# EAGLE design lickometer v1.0 (EAGLE 9.6.2)
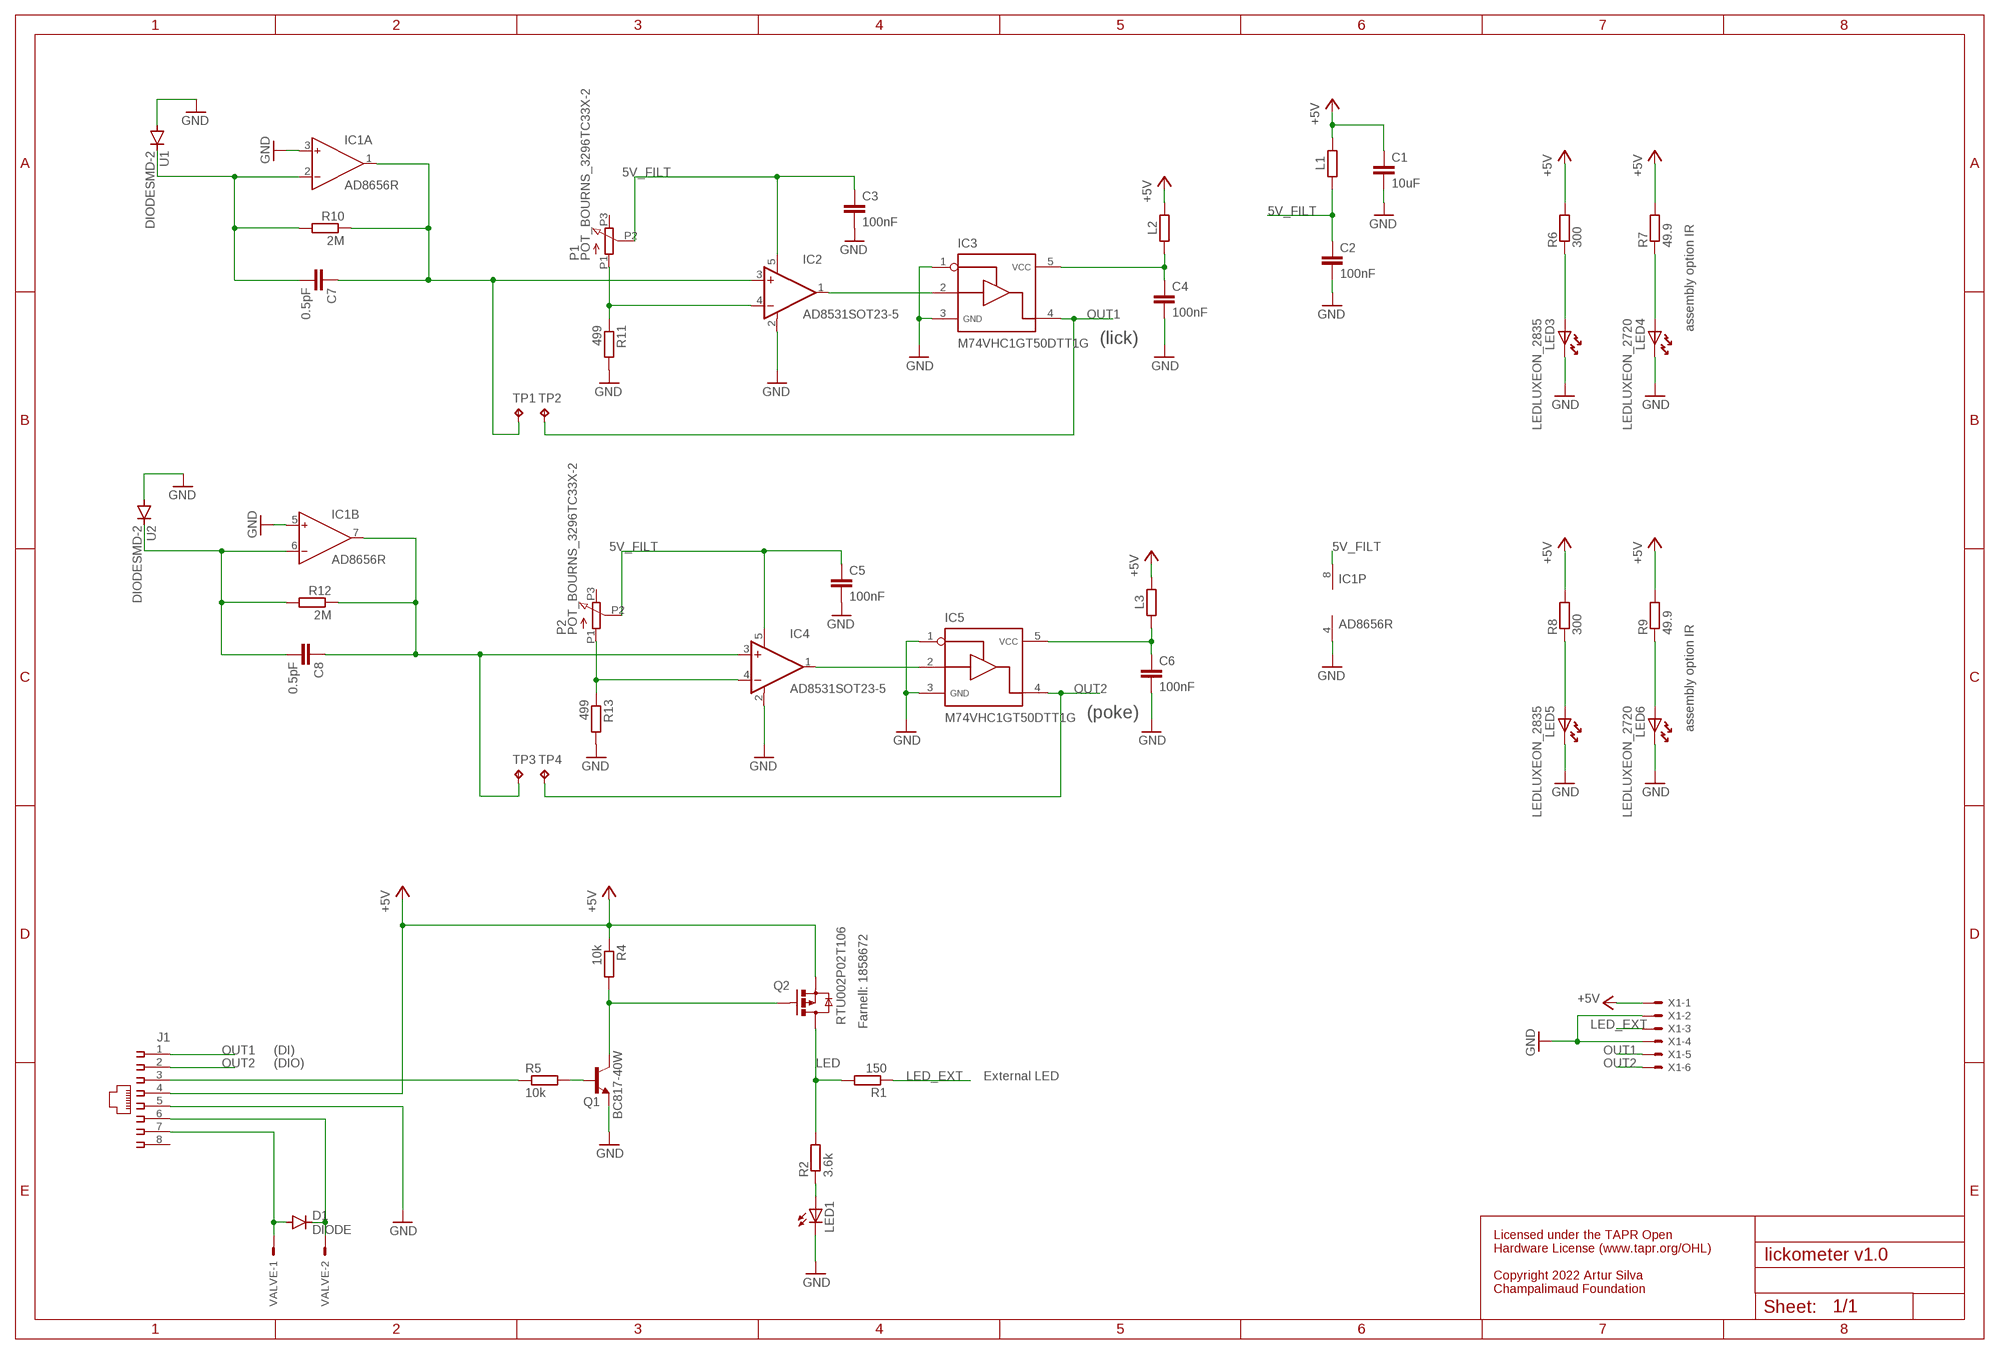
[diagram p0: schematic, sheet 1]

## Parts
C1  10uF  C-EUC0603  [C0603]
C2  100nF  C-EUC0402  [C0402]
C3  100nF  C-EUC0402  [C0402]
C4  100nF  C-EUC0402  [C0402]
C5  100nF  C-EUC0402  [C0402]
C6  100nF  C-EUC0402  [C0402]
C7  0.5pF  C-EUC0402  [C0402]
C8  0.5pF  C-EUC0402  [C0402]
D1  DIODE  [SOD-323-DIODE]
IC1  AD8656R  [SO8]
IC2  AD8531SOT23-5  [SOT23-5]
IC3  M74VHC1GT50DTT1G  SN74LVC1G125  [SOT23-5]
IC4  AD8531SOT23-5  [SOT23-5]
IC5  M74VHC1GT50DTT1G  SN74LVC1G125  [SOT23-5]
J1  215878-2  [215878-2]
L1  1k@100M  R-EU_R0402  [R0402]
L2  1k@100M  R-EU_R0402  [R0402]
L3  1k@100M  R-EU_R0402  [R0402]
LED1  LED3MM  [LED3MM]
LED3  LEDLUXEON_2835  [LED_LUXEON_2835]
LED4  LEDLUXEON_2720  [LED_LUXEON_2720]
LED5  LEDLUXEON_2835  [LED_LUXEON_2835]
LED6  LEDLUXEON_2720  [LED_LUXEON_2720]
P1  POT_BOURNS_3296TC33X-2  [POT-TC33X-2]
P2  POT_BOURNS_3296TC33X-2  [POT-TC33X-2]
Q1  BC817-40W  BC817  [SOT323-BEC]
Q2  RTU002P02T106  MOSFET-PCHANNEL-ROHM  [SOT323]
R1  150  R-EU_R0402  [R0402]
R2  3.6k  R-EU_R0402  [R0402]
R4  10k  R-EU_R0402  [R0402]
R5  10k  R-EU_R0402  [R0402]
R6  300  R-EU_R0805  [R0805]
R7  49.9  R-EU_R0805  [R0805]
R8  300  R-EU_R0805  [R0805]
R9  49.9  R-EU_R0805  [R0805]
R10  2M  R-EU_R0402  [R0402]
R11  499  R-EU_R0402  [R0402]
R12  2M  R-EU_R0402  [R0402]
R13  499  R-EU_R0402  [R0402]
TP1  TPTP08SQ  [TP08SQ]
TP2  TPTP08SQ  [TP08SQ]
TP3  TPTP08SQ  [TP08SQ]
TP4  TPTP08SQ  [TP08SQ]
U1  DIODESMD-2  [SMD-2]
U2  DIODESMD-2  [SMD-2]
VALVE  22-23-2021  [22-23-2021]
X1  22-23-2061  [22-23-2061]

## Nets
5V_FILT: C2.1 C3.1 C5.1 IC1.8(P:V+) IC2.5(V+) IC4.5(V+) L1.2 P1.P2(S) P2.P2(S)
+5V: C1.1 J1.4 L1.1 L2.2 L3.2 Q2.1(S) R4.1 R6.2 R7.2 R8.2 R9.2 X1.1
GND: C1.2 C2.2 C3.2 C4.2 C5.2 C6.2 IC1.3(A:IN+) IC1.4(P:V-) IC1.5(B:IN+) IC2.2(V-) IC3.1 IC3.3 IC4.2(V-) IC5.1 IC5.3 J1.5 LED1.K(C) LED3.KATHODE(K) LED4.KATHODE(K) LED5.KATHODE(K) LED6.KATHODE(K) Q1.E R11.2 R13.2 U1.A U2.A X1.2 X1.4
IN1: IC4.4(-IN) P2.P1(A) R13.1
IN2: IC2.4(-IN) P1.P1(A) R11.1
LED: Q2.3(D) R1.2 R2.2
LED_EXT: R1.1 X1.3
N$1: LED3.ANODE(A) R6.1
N$2: C4.1 IC3.5 L2.1
N$4: C7.2 IC1.2(A:IN-) R10.2 U1.C
N$5: D1.A J1.7 VALVE.1
N$6: D1.C J1.6 VALVE.2
N$7: IC2.1(OUT) IC3.2
N$8: J1.3 R5.1
N$9: C7.1 IC1.1(A:OUT) IC2.3(+IN) R10.1 TP1.TP
N$10: LED4.ANODE(A) R7.1
N$11: IC4.1(OUT) IC5.2
N$12: C6.1 IC5.5 L3.1
N$14: LED1.A R2.1
N$15: C8.2 IC1.6(B:IN-) R12.2 U2.C
N$16: C8.1 IC1.7(B:OUT) IC4.3(+IN) R12.1 TP3.TP
N$17: LED5.ANODE(A) R8.1
N$18: Q1.C Q2.2(G) R4.2
N$19: Q1.B R5.2
N$20: LED6.ANODE(A) R9.1
OUT1: IC3.4 J1.1 TP2.TP X1.5
OUT2: IC5.4 J1.2 TP4.TP X1.6
Unconnected: J1.8 P1.P3(E) P2.P3(E)

## Notes on the sheet
- assembly option IR
- (lick)
- (poke)
- assembly option IR
- Farnell: 1858672
- (DI)
- (DIO)
- External LED
- Licensed under the TAPR Open 
  Hardware License (www.tapr.org/OHL)
  
  Copyright 2022 Artur Silva
  Champalimaud Foundation

## Library data of the parts
C1-C8 = rcl:C-EU: CAPACITOR, European symbol; SPICEPREFIX: C
D1 U1 U2 = CNP-miscellaneous:DIODE
IC1 = analog-devices:AD8656: Low Noise, Precision CMOS Amplifier Source: http://www.analog.com/static/imported-files/data_sheets/AD8655_8656.pdf; MPN: AD8656ARZ; OC_FARNELL: 1117887; OC_NEWARK: 19M0993
IC2 IC4 = CNP-ics 1:AD8531
IC3 IC5 = My_library 0v2:SN74LVC1G125
J1 = con-amp:215878-2: AMP connector
L1-L3 R1 R2 R4-R13 = rcl:R-EU_: RESISTOR, European symbol; SPICEPREFIX: R
LED1 = adafruit:LED: LED OSRAM: - CHIPLED LG R971, LG N971, LY N971, LG Q971, LY Q971, LO R971, LY R971 LH N974, LH R974 LS Q976, LO Q976, LY Q976 LO Q996 - Hyper CHIPLED LW Q18S LB Q993, LB Q99A, LB R99A - SideLED LS A670, LO A670, LY A670, LG A670, LP A670 LB A673, LV A673, LT A673, LW A673 LH A674 LY A675 LS A676, LA A676, LO A676, LY A676, LW A676 LS A679, LY A679, LG A679 - Hyper Micro SIDELED® LS Y876, LA Y876, LO Y876, LY Y876 LT Y87S - SmartLED LW L88C, LW L88S LB L89C, LB L89S, LG L890 LS L89K, LO L89K, LY L89K LS L896, LA L896, LO L896, LY L896 - TOPLED LS T670, LO T670, LY T670, LG T670, LP T670 LSG T670, LSP T670, LSY T670, LOP T670, LYG T670 LG T671, LOG T671, LSG T671 LB T673, LV T673, LT T673, LW T673 LH T674 LS T676, LA T676, LO T676, LY T676, LB T676, LH T676, LSB T676, LW T676 LB T67C, LV T67C, LT T67C, LS T67K, LO T67K, LY T67K, LW E67C LS E67B, LA E67B, LO E67B, LY E67B, LB E67C, LV E67C, LT E67C LW T67C LS T679, LY T679, LG T679 LS T770, LO T770, LY T770, LG T770, LP T770 LB T773, LV T773, LT T773, LW T773 LH T774 LS E675, LA E675, LY E675, LS T675 LS T776, LA T776, LO T776, LY T776, LB T776 LHGB T686 LT T68C, LB T68C - Hyper Mini TOPLED® LB M676 - Mini TOPLED Santana® LG M470 LS M47K, LO M47K, LY M47K Source: http://www.osram.convergy.de/
LED3-LED6 = CNP-miscellaneous:LED
P1 P2 = CNP-miscellaneous:POT_BOURNS_3296
Q1 = transistor-npn:BC817*: NPN Transistor
Q2 = MOSFET:MOSFET-PCHANNEL-ROHM: PMOS (RTU002P02) Low On-Resistance. Low Gate Threshold Voltage. Low Input Capacitance. Fast Switching Speed. Manufacturer: ROHM
TP1-TP4 = testpad:TP: Test pad
VALVE = con-molex:22-23-2021: .100" (2.54mm) Center Header - 2 Pin; MF: MOLEX; MPN: 22-23-2021; OC_FARNELL: 1462926; OC_NEWARK: 25C3832
X1 = con-molex:22-23-2061: .100" (2.54mm) Center Header - 6 Pin; MF: MOLEX; MPN: 22-23-2061; OC_FARNELL: 1462922; OC_NEWARK: 27C1933

## Board
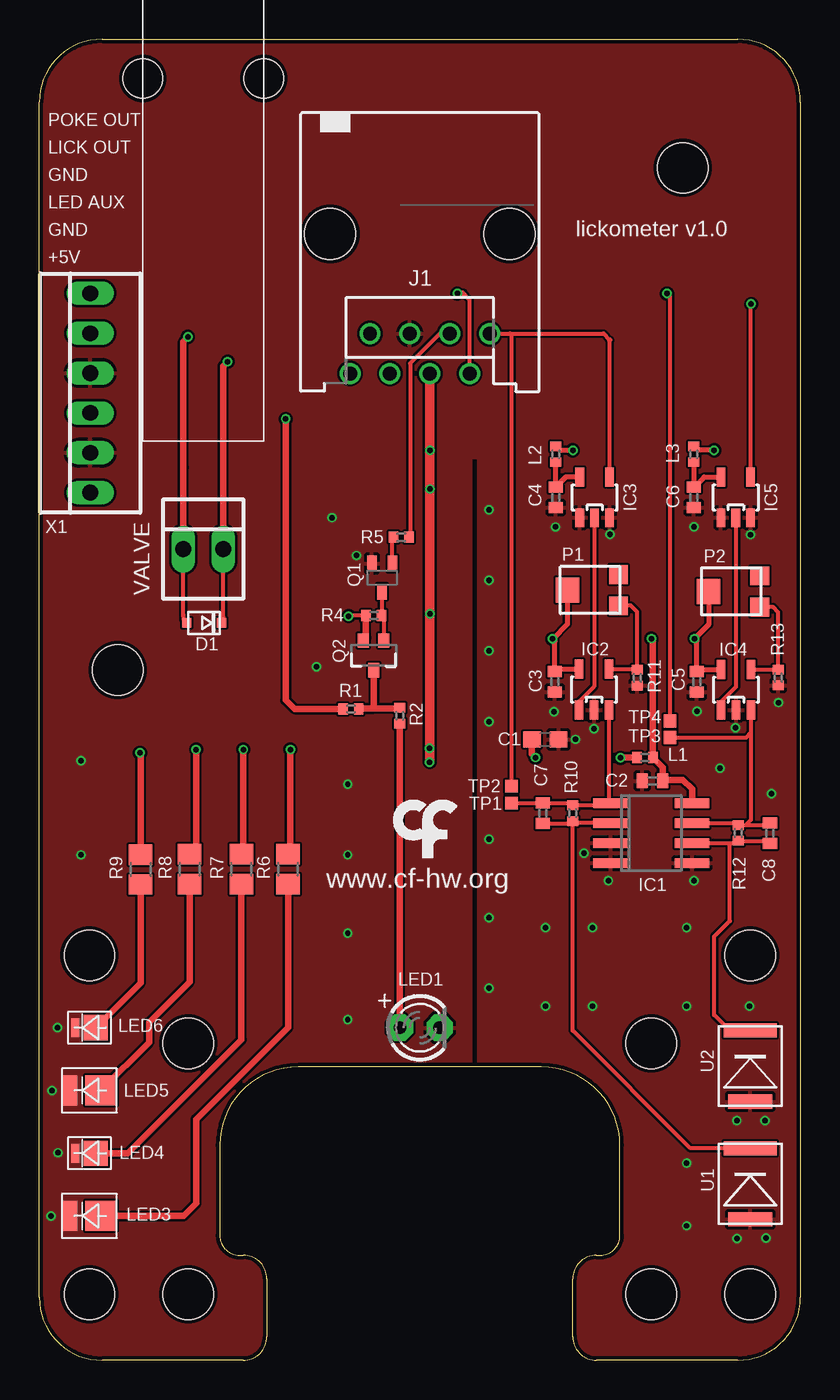
[diagram p1: board, top side]
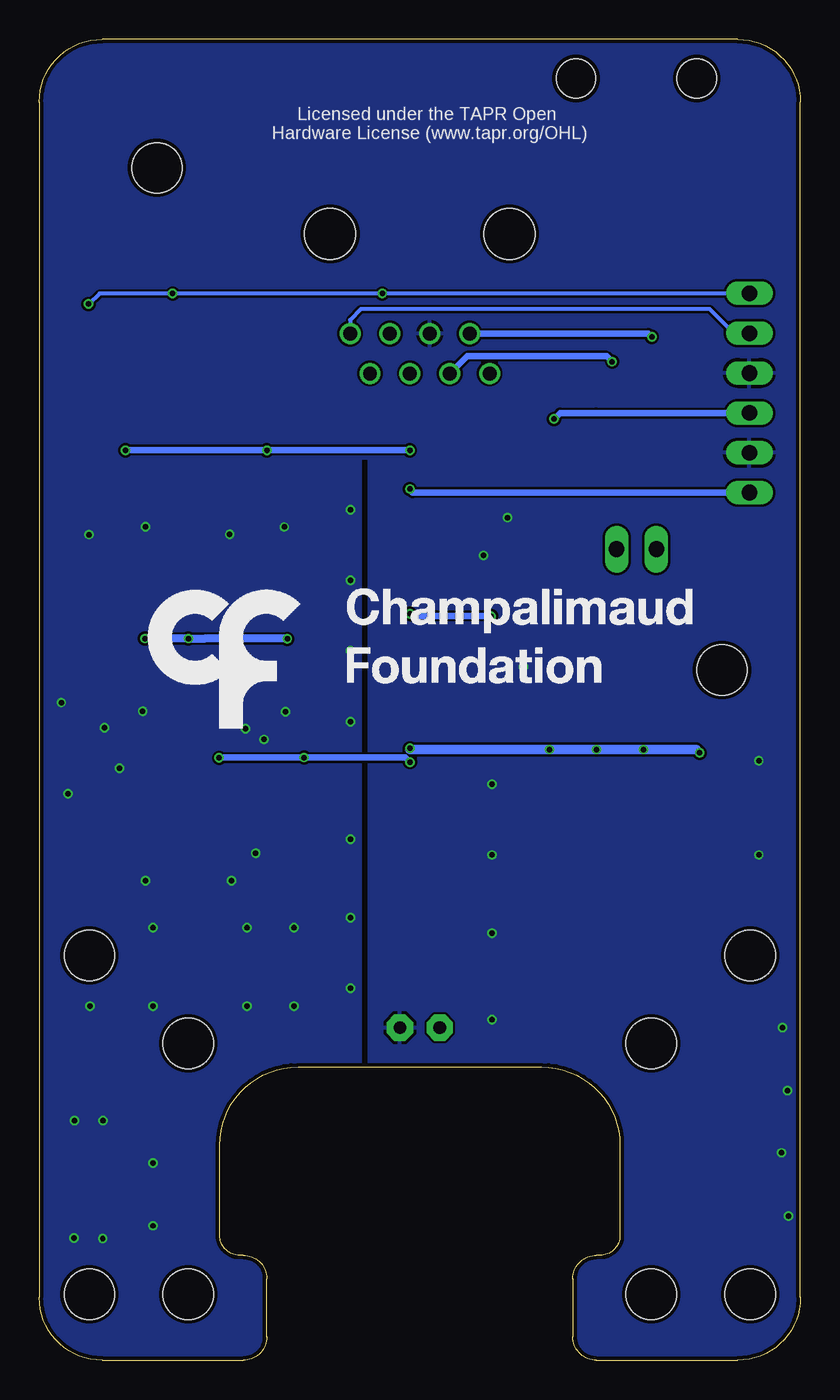
[diagram p2: board, bottom side, seen from below]

Size 48.5 x 84.2 mm. Coordinates in mm from the lower left corner, seen from the top.
Outline: 11.5,7.95 arc90 12.75,6.7 13,6.7 arc-90 14.5,5.2 14.5,1.5 arc-90 13,0 4,0 arc-90 0,4 0,80.2 arc-90 4,84.2 44.5,84.2 arc-90 48.5,80.2 48.5,4 arc-90 44.5,0 35.5,0 arc-90 34,1.5 34,5.2 arc-90 35.5,6.7 35.75,6.7 arc90 37,7.95 37,13.7 arc90 32,18.7 16.5,18.7 arc90 11.5,13.7 11.5,7.95
Copper layers (1*16): Top 0.018mm / dielectric 1.55mm / Bottom 0.018mm
Design rules "eC_2Layer_PClass6_BaseCopperO18_eCDefault *": minimum track width 0.15mm, minimum drill 0.35mm, track to track 0.15mm, track to pad 0.15mm, pad to pad 0.15mm, via to via 0.15mm, smd to smd 0mil, copper to edge 0.25mm, drill to drill 0.35mm, minimum pad ring 0.175mm, minimum via ring 0.125mm, stop-mask expansion 0mil, vias tented up to drill 0.45mm, thermal gap 0.2mm
Holes 3.2 mm at 41,76 3.2,4.2 39,4.2 3.2,25.8 39,20.2 9.5,20.2 45.3,4.2 9.5,4.2 45.3,25.8 5,44
Holes 2.5 mm at 14.3,81.7 6.6,81.7

### Footprints (pad centres in the part's own frame; a part is rotated, then mirrored left to right if it is on the bottom)
C0603 = smd 1.1 x 1: 1 -0.85,0; 2 0.85,0
C0402 = smd 0.7 x 0.9: 1 -0.65,0; 2 0.65,0
SOD-323-DIODE = smd 0.6 x 0.6: A 1.1,0; C -1.1,0
SO8 = smd 0.6 x 2.2: 1 -1.905,-2.6; 2 -0.635,-2.6; 3 0.635,-2.6; 4 1.905,-2.6; 5 1.905,2.6; 6 0.635,2.6; 7 -0.635,2.6; 8 -1.905,2.6
SOT23-5 = smd 0.55 x 1.2: 1 -0.95,-1.3; 2 0,-1.3; 3 0.95,-1.3; 4 0.95,1.3; 5 -0.95,1.3
215878-2 = drill 0.889: 1 -4.445,6.35; 2 -3.175,8.89; 3 -1.905,6.35; 4 -0.635,8.89; 5 0.635,6.35; 6 1.905,8.89; 7 3.175,6.35; 8 4.445,8.89 | hole 3.251: -5.715,0; 5.715,0
R0402 = smd 0.6 x 0.7: 1 -0.5,0; 2 0.5,0
LED3MM = drill 0.813 pad 1.676 octagon: A -1.27,0; K 1.27,0
LED_LUXEON_2835 = smd 2.03 x 1.9: ANODE 0.735,0 | smd 0.97 x 1.9: KATHODE -1.265,0
LED_LUXEON_2720 = smd 1.5 x 1.6: ANODE 0.4,0 | smd 0.5 x 1.2: KATHODE -0.9,0
POT-TC33X-2 = smd 1.2 x 1.2: P1 -1,-1.8; P3 1,-1.8 | smd 1.6 x 1.5: P2 0,1.45
SOT323-BEC = smd 0.6 x 1: B -0.65,-0.9; C 0,0.9; E 0.65,-0.9
SOT323 = smd 0.7 x 0.9: 1 0.65,-0.95; 2 -0.65,-0.95; 3 0,0.95
R0805 = smd 1.3 x 1.5: 1 -0.95,0; 2 0.95,0
TP08SQ = smd 0.8 x 0.8: TP 0,0
SMD-2 = smd 0.9 x 2.8: A 2.265,0 | smd 0.9 x 3.4: C -2.265,0
22-23-2021 = drill 1 long: 1 -1.27,0; 2 1.27,0
22-23-2061 = drill 1 long: 1 -6.35,0; 2 -3.81,0; 3 -1.27,0; 4 1.27,0; 5 3.81,0; 6 6.35,0

### Placement (x,y rotation side)
C1  32.24,39.56 0 top
C2  39.08,36.94 180 top
C3  32.85,43.25 270 top
C4  32.9,55 270 top
C5  41.9,43.24 270 top
C6  41.71,55 270 top
C7  32.08,34.86 270 top
C8  46.56,33.6 270 top
D1  10.5,47 180 top
IC1  39,33.6 270 top
IC2  35.35,42.75 0 top
IC3  35.39,55 0 top
IC4  44.4,42.74 0 top
IC5  44.38,55 0 top
J1  24.25,71.79 180 top
L1  38.59,38.41 0 top
L2  32.9,57.75 90 top
L3  41.71,57.75 90 top
LED1  24.25,21.2 0 top
LED3  3.2,9.2 0 top
LED4  3.2,13.2 0 top
LED5  3.2,17.2 0 top
LED6  3.2,21.2 0 top
P1  35.11,49.09 90 top
P2  44.1,49 90 top
Q1  21.85,49.88 180 top
Q2  21.31,44.93 180 top
R1  19.86,41.53 0 top
R2  22.98,41.08 90 top
R4  21.32,47.45 0 top
R5  23.07,52.45 180 top
R6  15.85,31.3 90 top
R7  12.87,31.3 90 top
R8  9.58,31.3 90 top
R9  6.45,31.28 90 top
R10  33.98,34.87 270 top
R11  38.1,43.5 270 top
R12  44.54,33.61 270 top
R13  47.08,43.51 270 top
TP1  30.09,35.5 0 top
TP2  30.1,36.58 0 top
TP3  40.2,39.69 0 top
TP4  40.19,40.74 0 top
U1  45.3,11.25 270 top
U2  45.3,18.75 270 top
U$1  [LOGO_5]  38.5,46 0 bottom
U$2  [LOGO_7]  23.78,34.44 0 top
VALVE  10.45,51.7 0 top
X1  3.25,61.65 90 top

### Tracks (layer width: path | path; a pad name or v marks a point on that pad's centre or on a via)
5V_FILT  (via drill 0.35)
  Top 0.305: IC4.5 42.05,44.04 C5.1 41.9,45.87 v41.77,46 | IC2.5 33,44.05 C3.1 32.85,45.84 v32.7,45.98 | v32.7,45.98 | v41.77,46 v41.76,46 | P2.P2 42.65,46.88 v41.77,46 | P1.P2 33.66,46.94 v32.7,45.98
  Top 0.406: IC1.8 41.6,36.4 41,37 39.79,37 C2.1 39.73,37.77 L1.2 39.09,45.91 v39,46
  Bottom 0.508: v32.7,45.98 32.72,46 38,46 v39,46 v41.76,46
+5V  (via drill 0.35, 0.35 pad 0.6)
  Top 0.254: Q2.1 20.82,46.04 | R4.1 19.9,47.45 19.88,47.43 v19.71,47.43
  Top 0.305: v43,58 41.96,58 L3.2 | L2.2 33.15,58 v34,58
  Top 0.406: L1.1 37.05,38.41 v37.04,38.4 | 20.82,46.04 R4.1 | C1.1 31.39,38.63 31.6,38.42 v31.62,38.42 | R6.2 16,32.4 v16,38.93 | R7.2 13,32.38 v13,38.93 | R8.2 10,32.67 v10,38.93 | R9.2 6.45,38.67 v6.42,38.71
  Top 0.61: v24.88,38.12 v24.88,39 v24.89,39.01 v24.89,47.58 v24.89,55.53 v24.89,58 J1.4
  Bottom 0.406: v24.88,38.12 25.17,38.42 v31.62,38.42 37.01,38.42 v37.04,38.4 | v24.89,58 v34,58 v43,58 | X1.1 24.72,55.3 24.89,55.48 v24.89,55.52 v24.89,55.53 | v19.71,47.43 24.77,47.43 24.89,47.55 v24.89,47.57 v24.89,47.58
  Bottom 0.61: v24.88,39 24.88,38.93 v16,38.93 v13,38.93 v10,38.93 6.64,38.93 v6.42,38.71
GND  (via drill 0.35)
  other vias: 34.71,32.32 41.72,30.57 32.8,41.33 41.91,41.37 35.35,40.25 41.72,53.12 32.89,53.11 36.36,52.64 45.33,52.63 34.17,39.57 36.26,30.57 44.44,15.28 46.25,15.29 44.45,7.77 46.3,7.8 1.16,21.21 0.81,17.2 1.21,13.22 0.76,9.2 20.2,51.29 44.35,40.32 43.37,37.74 47.1,41.92 46.66,36.1 35.26,27.57 35.26,22.57 32.26,22.57 32.26,27.57 41.26,27.57 41.26,22.57 45.26,22.57 41.26,8.57 41.26,12.57 19.66,36.71 19.66,32.21 19.66,27.21 19.66,21.71 2.66,32.21 2.66,38.21 18.66,53.71 17.66,44.21 28.66,54.21 28.66,49.71 28.66,45.21 28.66,40.71 28.66,33.21 28.66,28.21 28.66,23.71
  pour Top (rank 2): 0,84.2 48.5,84.2 48.5,0 28,0 28,57.5 27.5,57.5 27.5,0 0,0
  pour Bottom: 0,84.2 48.5,84.2 48.5,0 28,0 28,57.5 27.5,57.5 27.5,0 0,0
IN1
  Top 0.254: IC4.4 47.06,44.04 R13.1 47.08,47.67 46.76,48 P2.P1
IN2
  Top 0.254: IC2.4 38.05,44.05 R11.1 38.1,47.69 37.68,48.11 36.92,48.11 P1.P1
LED
  Top 0.406: Q2.3 21.31,41.56 | R2.2 22.95,41.56 22,41.56 21.98,41.56 21.31,41.56 | R1.2 20.39,41.56 21,41.56 21.31,41.56
LED_EXT  (via drill 0.35 pad 0.6)
  Top 0.406: v15.7,59.99 15.7,42.08 16.27,41.52 19.35,41.52 R1.1
  Bottom 0.406: v15.7,59.99 v15.69,59.99 15.31,60.38 13.02,60.38 | 13.02,60.38 | 13.02,60.38 X1.3
N$1
  Top 0.406: LED3.ANODE 9.2,9.2 10,10 10,15.36 15.85,21.21 R6.1
N$2
  Top 0.305: L2.1 C4.1 33.55,56.3 IC3.5
N$4
  Top 0.254: U1.C 41.48,13.52 33.98,21.02 R10.2 34.12,34.23 | IC1.2 34.12,34.23 | C7.2 34.09,34.21 34.12,34.23
N$5  (via drill 0.35 pad 0.6)
  Top 0.254: 9.18,56.91 9.18,47.5 9.18,47.4 9.18,47.22 D1.A
  Top 0.406: VALVE.1 9.18,56.91 9.18,64.94 v9.47,65.23
  Bottom 0.406: J1.7 9.69,65.45 v9.47,65.23
N$6  (via drill 0.35 pad 0.6)
  Top 0.254: 11.72,56.51 11.72,47.5 11.72,47.4 11.72,47.12 D1.C
  Top 0.406: VALVE.2 11.72,56.51 11.72,63.37 v12,63.65
  Bottom 0.406: v12,63.65 12.35,64 21.25,64 J1.6
N$7
  Top 0.254: IC2.1 34.4,42 35.36,42.96 35.36,53.67 IC3.2
N$8
  Top 0.254: J1.3 25.52,65.44 23.63,63.55 23.63,52.52 R5.1
N$9
  Top 0.254: IC2.3 36.3,35.6 IC1.1 36.27,35.37 R10.1 33.84,35.51 C7.1 TP1.TP
N$10
  Top 0.406: LED4.ANODE 5.64,13.2 12.87,20.43 R7.1
N$11
  Top 0.254: IC5.2 44.38,53.77 44.4,53.75 44.4,42.94 43.45,41.98 IC4.1
N$12
  Top 0.305: L3.1 C6.1 42.36,56.3 IC5.5
N$14
  Top 0.406: R2.1 LED1.A
N$15
  Top 0.254: IC1.6 44,32.97 | 44,32.97 44.4,32.97 R12.2 46.4,33.11 C8.2 | U2.C 43.98,21.02 43,22 43,27 44,28 44,32.97
N$16
  Top 0.254: IC1.7 44.41,34.23 R12.1 45,34.11 | 45,34.11 46.41,34.11 C8.1 | IC4.3 45.35,40 | 45.35,40 45.35,34.45 45,34.11 | TP3.TP 45.04,39.69 45.35,40
N$17
  Top 0.406: LED5.ANODE 7,20.27 7,21.55 9.58,24.13 R8.1
N$18
  Top 0.254: Q1.C 21.82,48.95 R4.2 21.96,47.31 Q2.2
N$19
  Top 0.254: Q1.B 22.5,52.39 R5.2
N$20
  Top 0.406: LED6.ANODE 6.45,24.05 R9.1
OUT1
  Top 0.254: J1.1 30,65.44 | 30,65.44 35.96,65.44 36.37,65.03 | IC3.4 36.34,65 | TP2.TP 30.09,65.34 30,65.44
  Top 0.305: 36.34,65 36.37,65.03
  Bottom 0.254: X1.5 4.25,65.46 5.79,67 28,67 28.7,66.31 J1.1
OUT2  (via drill 0.35)
  Top 0.254: J1.2 27.43,67.58 27,68 | IC5.4 45.33,67.3 | TP4.TP 40.19,67.81 v40,68 v40,67.99
  Top 0.305: 27,68 26.65,68 v26.64,67.99 | 45.33,67.3 v45.36,67.33
  Bottom 0.254: 3.78,67.99 v26.64,67.99 v40,67.99 44.65,67.99 45.34,67.31
  Bottom 0.305: X1.6 3.78,68 3.78,67.99 | 45.34,67.31 v45.36,67.33

### Text on the board
tPlace: POKE OUT | LICK OUT | GND | LED AUX | GND | lickometer v1.0 | +5V | www.cf-hw.org | Licensed under the TAPR Open / Hardware License (www.tapr.org/OHL) / / Copyright 2022 Artur Silva / Champalimaud Foundation
bPlace: Licensed under the TAPR Open / Hardware License (www.tapr.org/OHL)